# EAGLE schematic block_diagram_v1 (EAGLE 9.6.2)

## Sheet 1 of 4
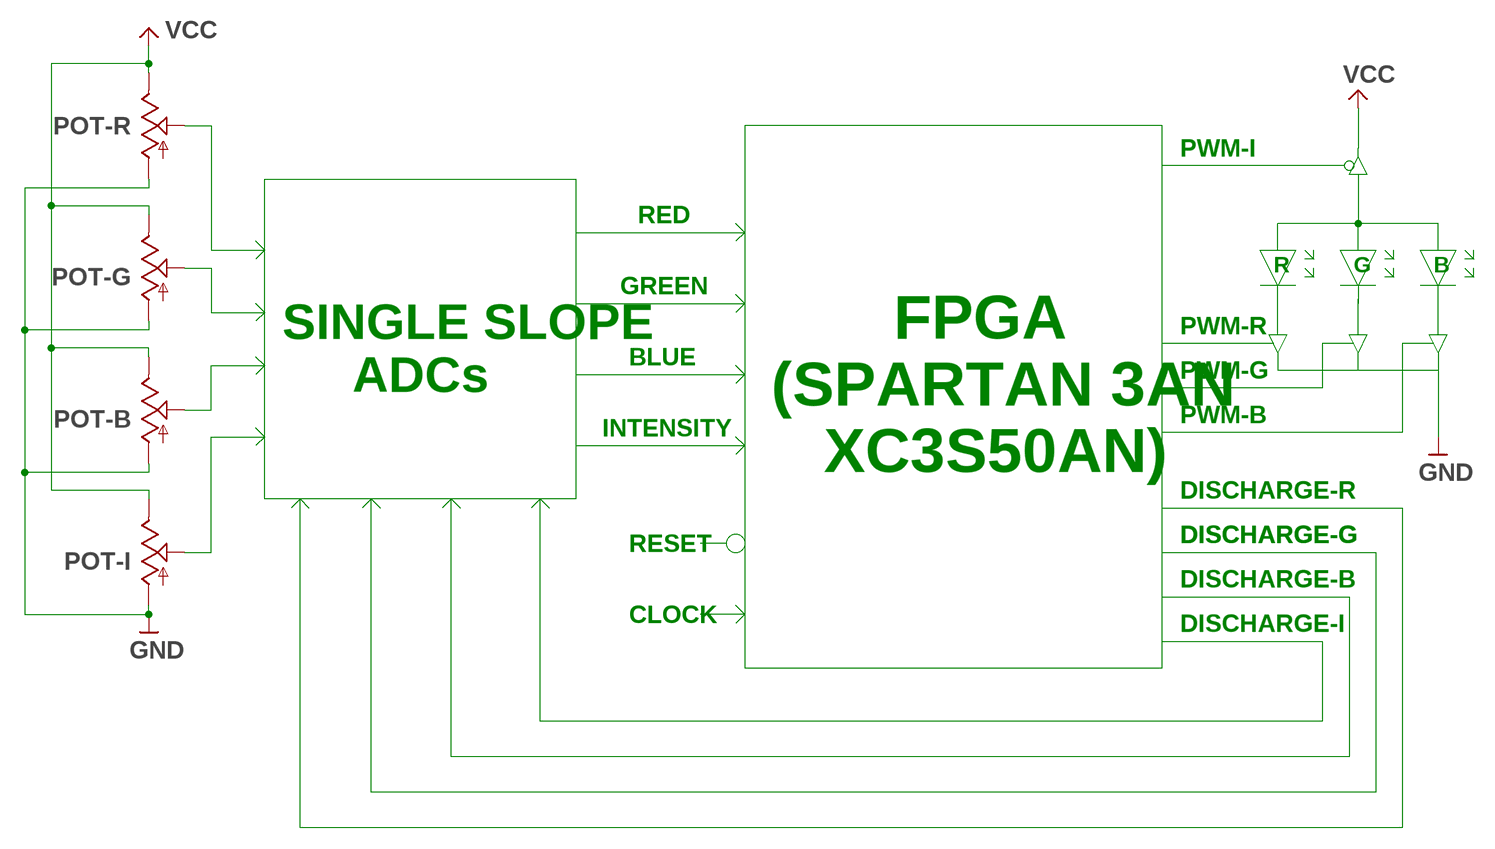
[diagram p0: schematic, sheet 1]

### Parts
POT-B  TRIM_US-3223G  [3223G]
POT-G  TRIM_US-3223G  [3223G]
POT-I  TRIM_US-3223G  [3223G]
POT-R  TRIM_US-3223G  [3223G]

### Nets
GND: POT-B.1(A) POT-G.1(A) POT-I.1(A) POT-R.1(A)
N$9: POT-R.2(S)
N$10: POT-G.2(S)
N$11: POT-B.2(S)
N$12: POT-I.2(S)
VCC: POT-B.3(E) POT-G.3(E) POT-I.3(E) POT-R.3(E) ; supply symbol labelled GND

### Notes on the sheet
- PWM-I
- RED
- R | G | B
- GREEN
- PWM-R
- BLUE
- PWM-G
- SINGLE SLOPE
       ADCs
- PWM-B
- INTENSITY
- FPGA
  (SPARTAN 3AN
     XC3S50AN)
- DISCHARGE-R
- DISCHARGE-G | DISCHARGE-G
- RESET
- DISCHARGE-B
- CLOCK
- DISCHARGE-I

## Sheet 2 of 4
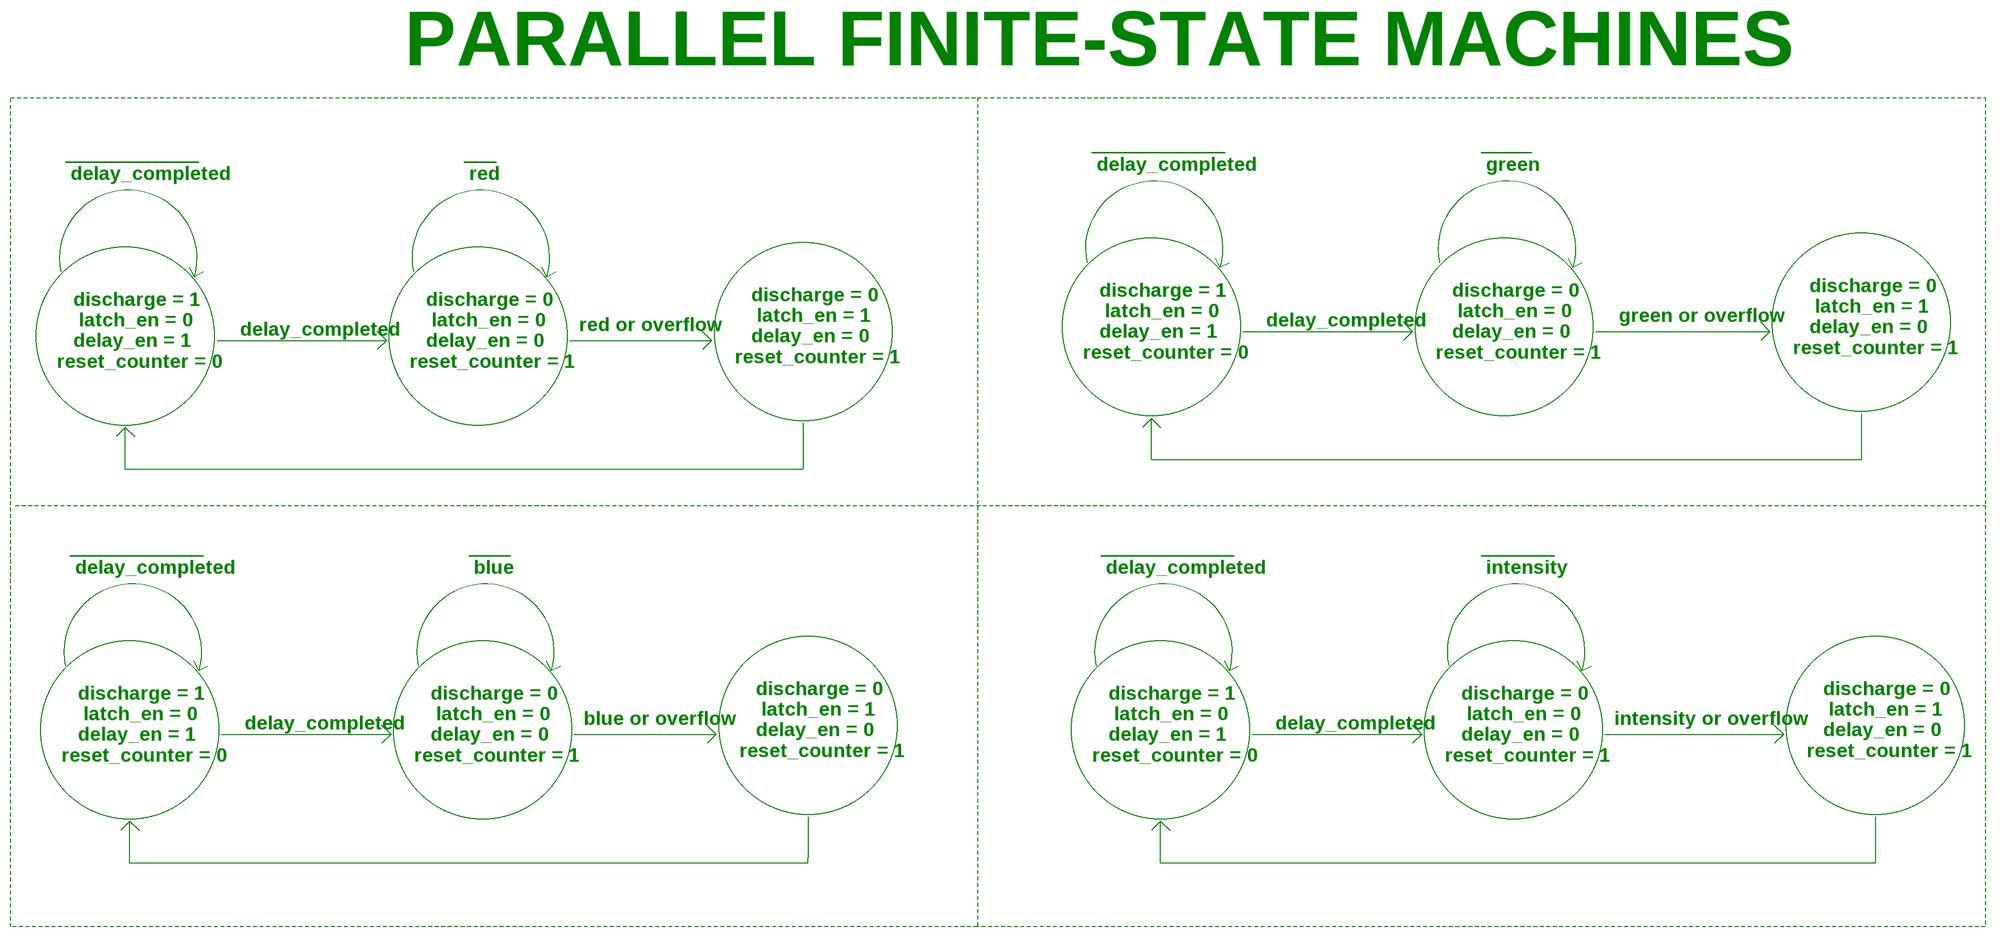
[diagram p1: schematic, sheet 2]

### Notes on the sheet
- PARALLEL FINITE-STATE MACHINES
- delay_completed | green
- delay_completed | red
- delay_completed | green or overflow
- delay_completed | red or overflow
- discharge = 0
      latch_en = 1
     delay_en = 0
  reset_counter = 1
- discharge = 1
      latch_en = 0
     delay_en = 1
  reset_counter = 0
- discharge = 0
      latch_en = 0
     delay_en = 0
  reset_counter = 1
- discharge = 0
      latch_en = 1
     delay_en = 0
  reset_counter = 1
- discharge = 1
      latch_en = 0
     delay_en = 1
  reset_counter = 0
- discharge = 0
      latch_en = 0
     delay_en = 0
  reset_counter = 1
- delay_completed | blue | delay_completed | intensity
- delay_completed | blue or overflow | delay_completed | intensity or overflow
- discharge = 0
      latch_en = 1
     delay_en = 0
  reset_counter = 1
- discharge = 0
      latch_en = 1
     delay_en = 0
  reset_counter = 1
- discharge = 1
      latch_en = 0
     delay_en = 1
  reset_counter = 0
- discharge = 0
      latch_en = 0
     delay_en = 0
  reset_counter = 1
- discharge = 1
      latch_en = 0
     delay_en = 1
  reset_counter = 0
- discharge = 0
      latch_en = 0
     delay_en = 0
  reset_counter = 1

## Sheet 3 of 4
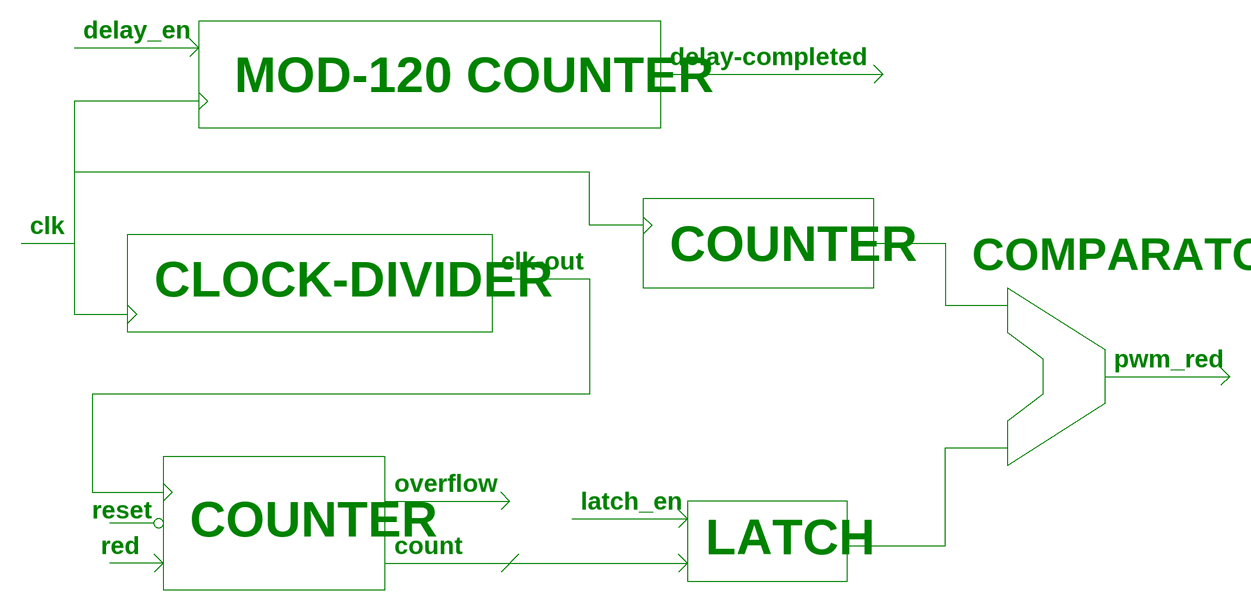
[diagram p2: schematic, sheet 3]

### Notes on the sheet
- delay_en
- delay-completed
- MOD-120 COUNTER
- clk
- COUNTER
- clk-out | COMPARATOR
- CLOCK-DIVIDER
- pwm_red
- overflow
- latch_en
- reset
- COUNTER
- red | count | LATCH

## Sheet 4 of 4

## Library data of the parts
POT-B POT-G POT-I POT-R = pot:TRIM_US-: POTENTIOMETER